# EAGLE schematic ethernet-expansion (EAGLE 7.2.0)
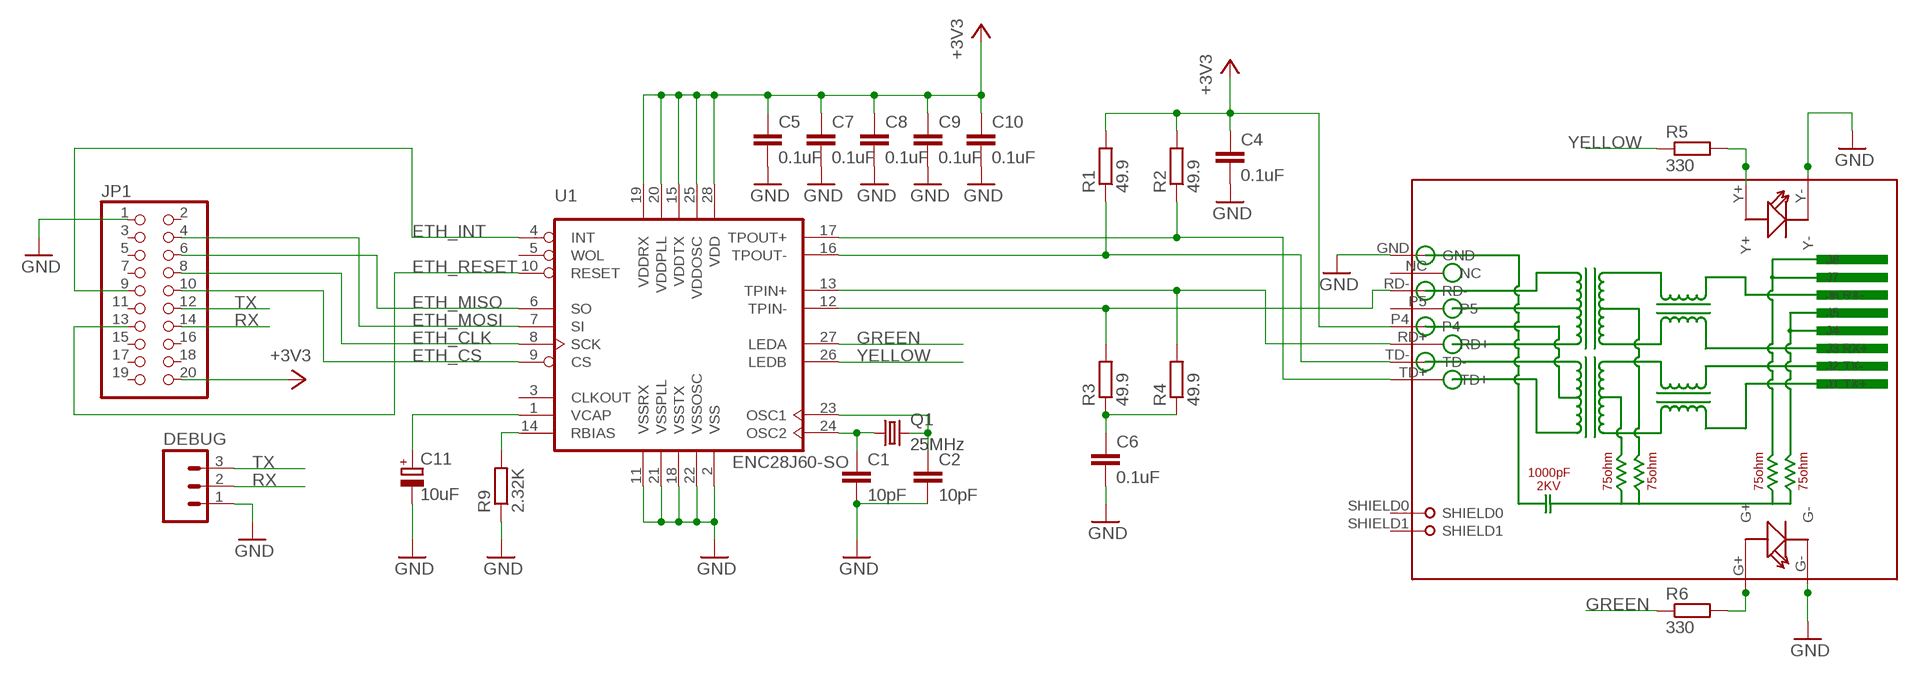
[diagram p0: schematic, sheet 1]

## Parts
C1  10pF  C-EUC0805  [C0805]
C2  10pF  C-EUC0805  [C0805]
C4  0.1uF  C-EUC0805  [C0805]
C5  0.1uF  C-EUC0805  [C0805]
C6  0.1uF  C-EUC0805  [C0805]
C7  0.1uF  C-EUC0805  [C0805]
C8  0.1uF  C-EUC0805  [C0805]
C9  0.1uF  C-EUC0805  [C0805]
C10  0.1uF  C-EUC0805  [C0805]
C11  10uF  CPOL-EUE2-4  [E2-4]
DEBUG  M03PTH  [1X03]
JP1  PINHD-2X10  [2X10]
Q1  25MHz  CRYSTALHC49S  [HC49/S]
R1  49.9  R-EU_M0805  [M0805]
R2  49.9  R-EU_M0805  [M0805]
R3  49.9  R-EU_M0805  [M0805]
R4  49.9  R-EU_M0805  [M0805]
R5  330  R-EU_M0805  [M0805]
R6  330  R-EU_M0805  [M0805]
R9  2.32K  R-EU_M0805  [M0805]
RJ1  HR911105A  [HR911105A]
U1  ENC28J60-SO  [SO28W]

## Nets
+3V3: C4.1 C5.1 C7.1 C8.1 C9.1 C10.1 JP1.20 R1.2 R2.2 RJ1.P4 U1.15(VDDTX) U1.19(VDDRX) U1.20(VDDPLL) U1.25(VDDOSC) U1.28(VDD)
ETH_CLK: JP1.8 U1.8(SCK)
ETH_CS: JP1.10 U1.9(CS)
ETH_INT: JP1.9 U1.4(INT)
ETH_MISO: JP1.6 U1.6(SO)
ETH_MOSI: JP1.4 U1.7(SI)
ETH_RESET: JP1.13 U1.10(RESET)
GND: C1.2 C2.2 C4.2 C5.2 C6.2 C7.2 C8.2 C9.2 C10.2 C11.- DEBUG.1 JP1.1 R9.1 RJ1.G- RJ1.GND RJ1.Y- U1.2(VSS) U1.11(VSSRX) U1.18(VSSTX) U1.21(VSSPLL) U1.22(VSSOSC)
GREEN: R6.1 U1.27(LEDA)
N$8: C6.1 R3.1 R4.1
N$9: R5.2 RJ1.Y+
N$10: R6.2 RJ1.G+
N$11: C1.1 Q1.1 U1.24(OSC2)
N$12: C2.1 Q1.2 U1.23(OSC1)
N$13: R9.2 U1.14(RBIAS)
N$14: C11.+ U1.1(VCAP)
RX: DEBUG.2 JP1.14
TPIN_N: R3.2 RJ1.RD- U1.12(TPIN-)
TPIN_P: R4.2 RJ1.RD+ U1.13(TPIN+)
TPOUT_N: R1.1 RJ1.TD- U1.16(TPOUT-)
TPOUT_P: R2.1 RJ1.TD+ U1.17(TPOUT+)
TX: DEBUG.3 JP1.12
YELLOW: R5.1 U1.26(LEDB)
Unconnected: JP1.2 JP1.3 JP1.5 JP1.7 JP1.11 JP1.15 JP1.16 JP1.17 JP1.18 JP1.19 RJ1.NC RJ1.P5 RJ1.SHIELD0 RJ1.SHIELD1 U1.3(CLKOUT) U1.5(WOL)

## Library data of the parts
C1 C2 C4-C10 = resistor:C-EU: CAPACITOR, European symbol
C11 = resistor:CPOL-EU: POLARIZED CAPACITOR, European symbol
DEBUG = SparkFun-Connectors:M03: Header 3 Standard 3-pin 0.1" header. Use with straight break away headers (SKU : PRT-00116), right angle break away headers (PRT-00553), swiss pins (PRT-00743), machine pins (PRT-00117), and female headers (PRT-00115). Molex polarized connector foot print use with SKU : PRT-08232 with associated crimp pins and housings.
JP1 = SparkFun-Connectors:PINHD-2X10: PIN HEADER
Q1 = crystal:CRYSTAL: CRYSTAL; OC_FARNELL: 1667008; OC_NEWARK: unknown
R1-R6 R9 = resistor:R-EU_: RESISTOR, European symbol
RJ1 = CONNECTER:HR911105A
U1 = microchip-enc28j60:ENC28J60-*: Microchip 10Mbit Eth. contoller with SPI interface